# Altium schematic sheet Dogfish3D - MCU - ATSAMD21G18 .SchDoc
size B
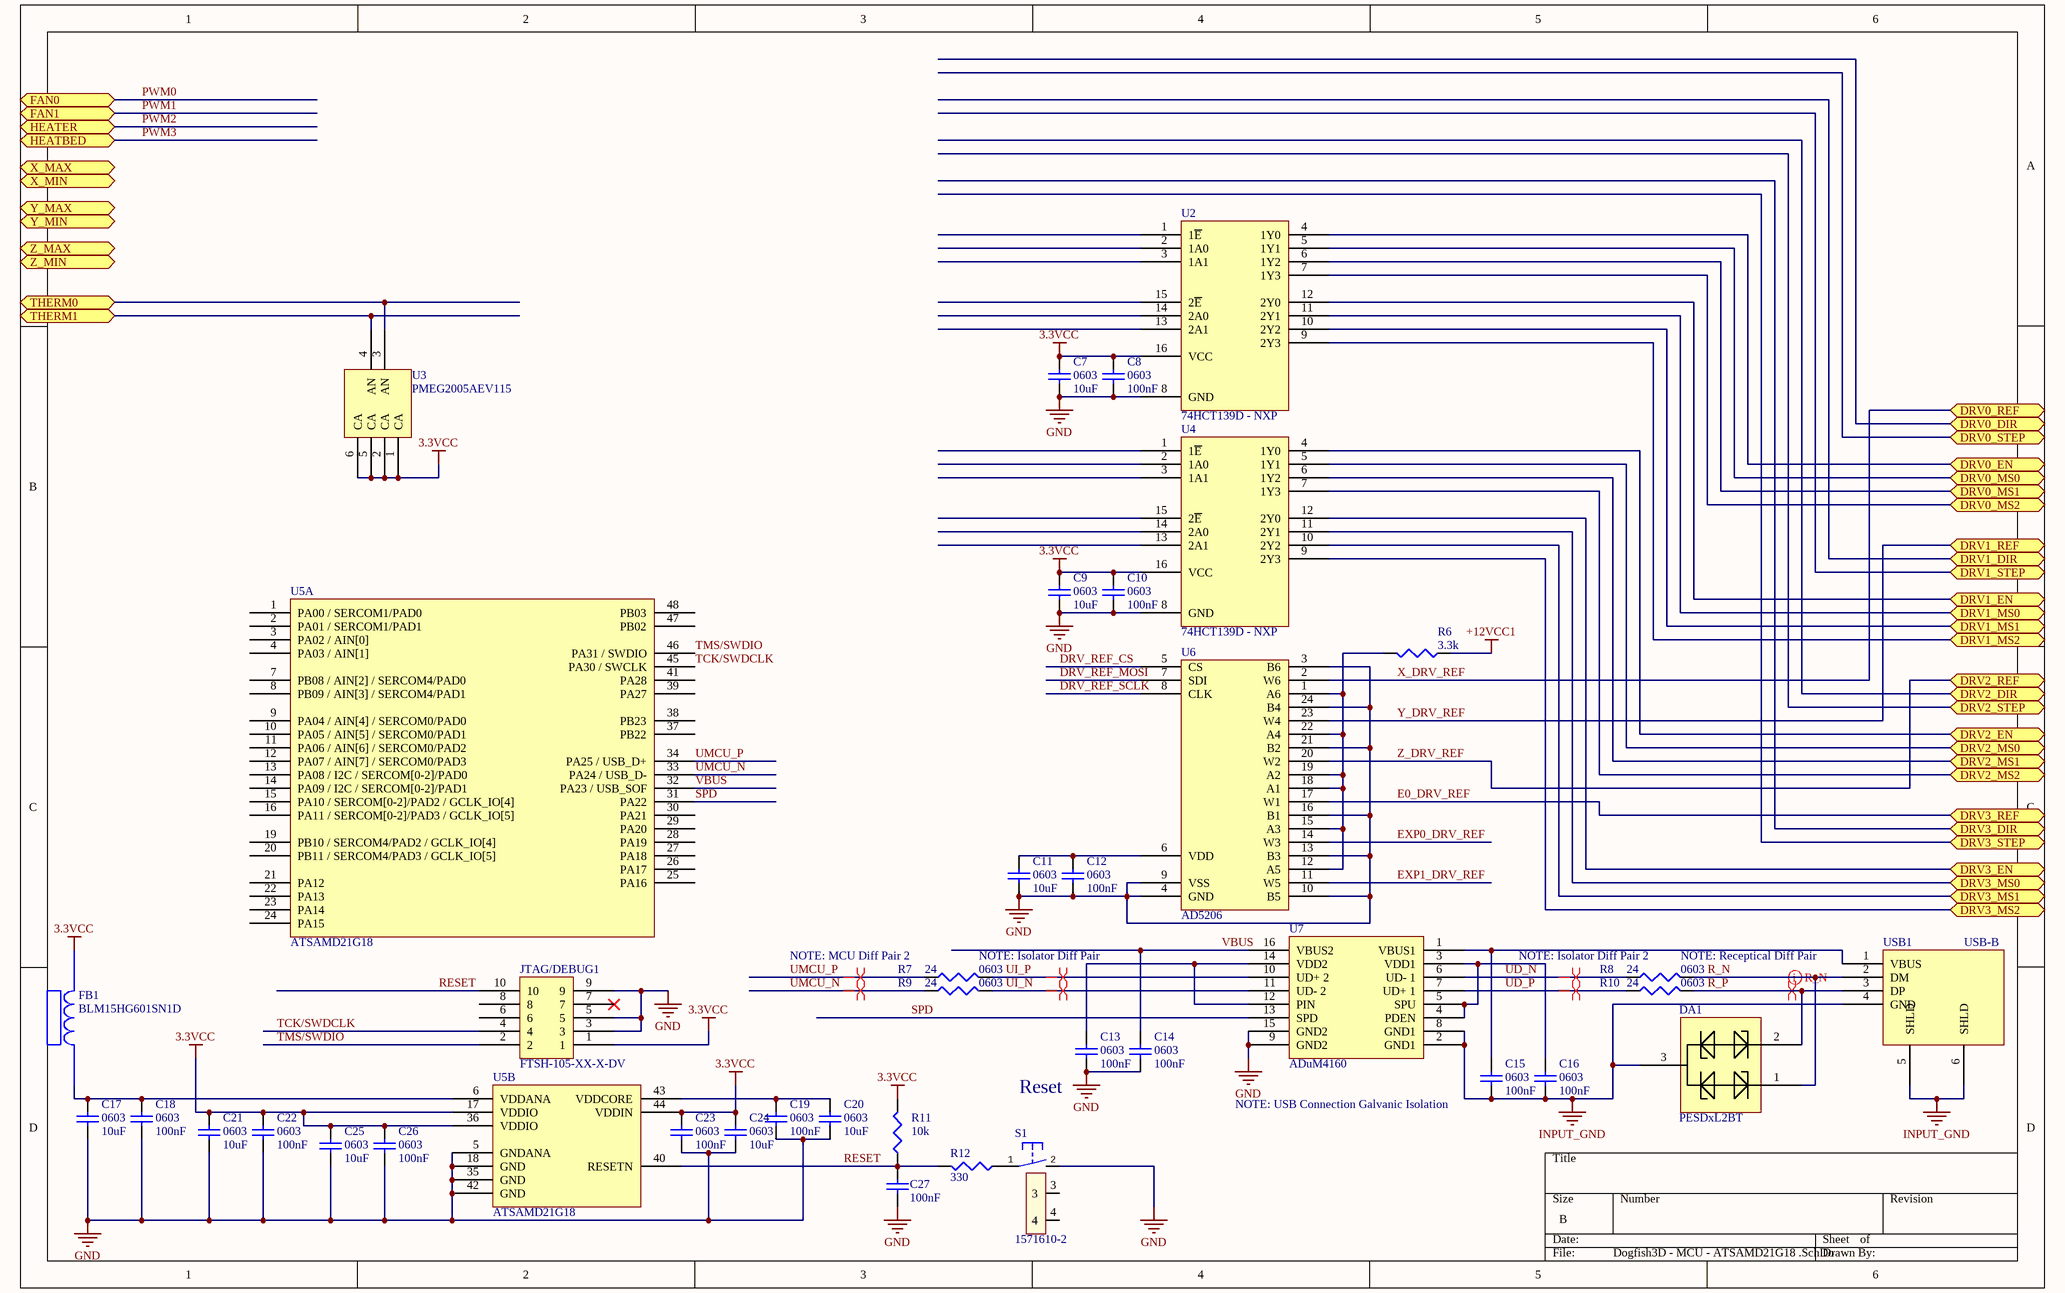
[diagram p0: Dogfish3D - MCU - ATSAMD21G18 .SchDoc]

## Parts
C7  0603  value 10uF  [1608[0603]]
C8  0603  value 100nF  [1608[0603]]
C9  0603  value 10uF  [1608[0603]]
C10  0603  value 100nF  [1608[0603]]
C11  0603  value 10uF  [1608[0603]]
C12  0603  value 100nF  [1608[0603]]
C13  0603  value 100nF  [1608[0603]]
C14  0603  value 100nF  [1608[0603]]
C15  0603  value 100nF  [1608[0603]]
C16  0603  value 100nF  [1608[0603]]
C17  0603  value 10uF  [1608[0603]]
C18  0603  value 100nF  [1608[0603]]
C19  0603  value 100nF  [1608[0603]]
C20  0603  value 10uF  [1608[0603]]
C21  0603  value 10uF  [1608[0603]]
C22  0603  value 100nF  [1608[0603]]
C23  0603  value 100nF  [1608[0603]]
C24  0603  value 10uF  [1608[0603]]
C25  0603  value 10uF  [1608[0603]]
C26  0603  value 100nF  [1608[0603]]
C27  value 100nF  [1608[0603]]  (hidden comment: Cap Semi)
DA1  PESDxL2BT  [SOT95P230X110-3N]
FB1  BLM15HG601SN1D  [BLM18PG121SN1D]
JTAG/DEBUG1  FTSH-105-XX-X-DV  [FTSH-105-XX-X-DV]
R6  value 3.3k  [J1-0603]  (hidden comment: Res3)
R7  0603  value 24  [J1-0603]
R8  0603  value 24  [J1-0603]
R9  0603  value 24  [J1-0603]
R10  0603  value 24  [J1-0603]
R11  value 10k  [J1-0603]  (hidden comment: Res3)
R12  value 330  [J1-0603]  (hidden comment: Res3)
S1  1571610-2  [B3F-31XX]
U2  74HCT139D - NXP  [SOIC127P600X175-16N]
U3  PMEG2005AEV115  [PMEG2005AEV115]
U4  74HCT139D - NXP  [SOIC127P600X175-16N]
U5  ATSAMD21G18  [TSQFP50P900X900X120-48N]  (parts A,B of 2)
U6  AD5206  [AD5206 & AD5204]
U7  ADuM4160  [ADuM4160]
USB1  USB-B  [PN61729]

## Ports
DRV0_DIR, DRV0_EN, DRV0_MS0, DRV0_MS1, DRV0_MS2, DRV0_REF, DRV0_STEP, DRV1_DIR, DRV1_EN, DRV1_MS0, DRV1_MS1, DRV1_MS2, DRV1_REF, DRV1_STEP, DRV2_DIR, DRV2_EN, DRV2_MS0, DRV2_MS1, DRV2_MS2, DRV2_REF, DRV2_STEP, DRV3_DIR, DRV3_EN, DRV3_MS0, DRV3_MS1, DRV3_MS2, DRV3_REF, DRV3_STEP, FAN0, FAN1, HEATBED, HEATER, THERM0, THERM1, X_MAX, X_MIN, Y_MAX, Y_MIN, Z_MAX, Z_MIN

## Nets
3.3VCC: C7.2 C8.2 C9.2 C10.2 C21.2 C22.2 C23.2 C24.2 C25.2 C26.2 FB1.2 JTAG/DEBUG1.1 R11.2 U2.16(VCC) U3.1(CA) U3.2(CA) U3.5(CA) U3.6(CA) U4.16(VCC) U5.17(VDDIO) U5.36(VDDIO) U5.44(VDDIN)
+12VCC1: R6.1
GND: C7.1 C8.1 C9.1 C10.1 C11.1 C12.1 C13.1 C14.1 C17.1 C18.1 C19.1 C20.1 C21.1 C22.1 C23.1 C24.1 C25.1 C26.1 C27.1 JTAG/DEBUG1.3 JTAG/DEBUG1.5 JTAG/DEBUG1.9 S1.2(S) U2.8(GND) U4.8(GND) U5.5(GNDANA) U5.18(GND) U5.35(GND) U5.42(GND) U6.3(B6) U6.4(GND) U6.9(VSS) U6.10(B5) U6.13(B3) U6.16(B1) U6.21(B2) U6.24(B4) U7.9(GND2) U7.15(GND2)
INPUT_GND: C15.1 C16.1 DA1.3 U7.2(GND1) U7.8(GND1) USB1.4(GND) USB1.5(SHLD) USB1.6(SHLD)
DRV0_EN: U2.4(1Y0) ; port DRV0_EN
DRV0_MS0: U2.5(1Y1) ; port DRV0_MS0
DRV0_MS1: U2.6(1Y2) ; port DRV0_MS1
DRV0_MS2: U2.7(1Y3) ; port DRV0_MS2
DRV1_EN: U2.12(2Y0) ; port DRV1_EN
DRV1_MS0: U2.11(2Y1) ; port DRV1_MS0
DRV1_MS1: U2.10(2Y2) ; port DRV1_MS1
DRV1_MS2: U2.9(2Y3) ; port DRV1_MS2
DRV2_EN: U4.4(1Y0) ; port DRV2_EN
DRV2_MS0: U4.5(1Y1) ; port DRV2_MS0
DRV2_MS1: U4.6(1Y2) ; port DRV2_MS1
DRV2_MS2: U4.7(1Y3) ; port DRV2_MS2
DRV3_EN: U4.12(2Y0) ; port DRV3_EN
DRV3_MS0: U4.11(2Y1) ; port DRV3_MS0
DRV3_MS1: U4.10(2Y2) ; port DRV3_MS1
DRV3_MS2: U4.9(2Y3) ; port DRV3_MS2
DRV_REF_CS: U6.5(CS)
DRV_REF_MOSI: U6.7(SDI)
DRV_REF_SCLK: U6.8(CLK)
E0_DRV_REF: U6.17(W1) ; port DRV3_REF
EXP0_DRV_REF: U6.14(W3)
EXP1_DRV_REF: U6.11(W5)
PWM0: port FAN0
PWM1: port FAN1
PWM2: port HEATER
PWM3: port HEATBED
R_N: DA1.1 R8.2 USB1.2(DM)
R_P: DA1.2 R10.2 USB1.3(DP)
RESET: C27.2 JTAG/DEBUG1.10 R11.1 R12.2 U5.40(RESETN)
SPD: U5.31(PA22) U7.13(SPD)
TCK/SWDCLK: JTAG/DEBUG1.4 U5.45(PA30_/_SWCLK)
THERM0: U3.3(AN) ; port THERM0
THERM1: U3.4(AN) ; port THERM1
TMS/SWDIO: JTAG/DEBUG1.2 U5.46(PA31_/_SWDIO)
UD_N: R8.1 U7.6(UD-_1)
UD_P: R10.1 U7.7(UD+_1)
UI_N: R9.2 U7.11(UD-_2)
UI_P: R7.2 U7.10(UD+_2)
UMCU_N: R9.1 U5.33(PA24_/_USB_D-)
UMCU_P: R7.1 U5.34(PA25_/_USB_D+)
VBUS: C14.2 U5.32(PA23_/_USB_SOF) U7.16(VBUS2)
X_DRV_REF: U6.2(W6) ; port DRV0_REF
Y_DRV_REF: U6.23(W4) ; port DRV1_REF
Z_DRV_REF: U6.20(W2) ; port DRV2_REF
NetC11_2: C11.2 C12.2 U6.6(VDD)
NetC13_2: C13.2 U7.12(PIN) U7.14(VDD2)
NetC15_2: C15.2 U7.1(VBUS1) USB1.1(VBUS)
NetC16_2: C16.2 U7.3(VDD1) U7.4(PDEN) U7.5(SPU)
NetC17_2: C17.2 C18.2 FB1.1 U5.6(VDDANA)
NetC19_2: C19.2 C20.2 U5.43(VDDCORE)
NetR6_2: R6.2 U6.1(A6) U6.12(A5) U6.15(A3) U6.18(A1) U6.19(A2) U6.22(A4)
NetR12_1: R12.1 S1.1(P)

Not connected (* = marked no-connect by the designer): JTAG/DEBUG1 6 7* 8; S1 3 4; U2 1(1~{E}) 2(1A0) 3(1A1) 13(2A1) 14(2A0) 15(2~{E}); U4 1(1~{E}) 2(1A0) 3(1A1) 13(2A1) 14(2A0) 15(2~{E}); U5 1(PA00_/_SERCOM1/PAD0) 2(PA01_/_SERCOM1/PAD1) 3(PA02_/_AIN[0]) 4(PA03_/_AIN[1]) 7(PB08_/_AIN[2]_/_SERCOM4/PAD0) 8(PB09_/_AIN[3]_/_SERCOM4/PAD1) 9(PA04_/_AIN[4]_/_SERCOM0/PAD0) 10(PA05_/_AIN[5]_/_SERCOM0/PAD1) 11(PA06_/_AIN[6]_/_SERCOM0/PAD2) 12(PA07_/_AIN[7]_/_SERCOM0/PAD3) 13(PA08_/_I2C_/_SERCOM[0-2]/PAD0) 14(PA09_/_I2C_/_SERCOM[0-2]/PAD1) 15(PA10_/_SERCOM[0-2]/PAD2_/_GCLK_IO[4]) 16(PA11_/_SERCOM[0-2]/PAD3_/_GCLK_IO[5]) 19(PB10_/_SERCOM4/PAD2_/_GCLK_IO[4]) 20(PB11_/_SERCOM4/PAD3_/_GCLK_IO[5]) 21(PA12) 22(PA13) 23(PA14) 24(PA15) 25(PA16) 26(PA17) 27(PA18) 28(PA19) 29(PA20) 30(PA21) 37(PB22) 38(PB23) 39(PA27) 41(PA28) 47(PB02) 48(PB03)

## Layout directives
differential pair: R_N, R_P, UD_N, UD_P, UI_N, UI_P, UMCU_N, UMCU_P

## Notes on the sheet
- NOTE: MCU Diff Pair 2
- (near R7) NOTE: Isolator Diff Pair
- (near R8) NOTE: Isolator Diff Pair 2
- (near R8) NOTE: Receptical Diff Pair
- (near C13) Reset
- (near C15) NOTE: USB Connection Galvanic Isolation

## Library data of the parts
C7-C27 = Cap Semi: Capacitor (Semiconductor SIM Model); Published: 8-Jun-2000; LatestRevisionDate: 29-May-2009; LatestRevisionNote: IPC-7351 Footprint Added.; PackageReference: C1206; Publisher: Altium Limited; PackageDescription: Chip Capacitor
DA1 = PESDxL2BT: PESDxL2BT TVS Diode Array 2x
JTAG/DEBUG1 = ARM Cortex JTAG-DEBUG Header
R6-R12 = Res3: Resistor; Published: 8-Jun-2000; LatestRevisionDate: 29-May-2009; LatestRevisionNote: IPC-7351 Footprint Added.; PackageReference: J1-0603; Publisher: Altium Limited; PackageDescription: Chip Resistor
S1 = 1571610-2_1: SWTCH Momentary Washable; Manufacturer: Omron; Manufacturer: TE; LastRevisionNote: Import; ComponentLink1URL: http://www.te.com/commerce/DocumentDelivery/DDEController?Action=srchrtrv&DocNm=1571610&DocType=Customer+Drawing&DocLang=English; ComponentLink1Description: Datasheet for B3F-31XX; Published: 23-Apr-2014; Publisher: UltiMachine; LastRevisionDate: 23-Apr-2014; ManufacturerPartNumber: 1571610-2; Supplier 1: Mouser; Supplier Part Number 1: 506-1571610-2
U2 U4 = 74HCT139D - NXP: 74HCT139D 2-4 dual Decoder from NXP
U7 = ADuM4160: USB Opto Isolator